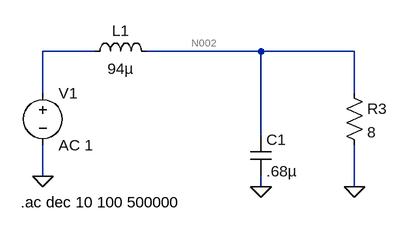
[diagram p0: schematic filter simulation.asc]
filter simulation.asc, the LTspice schematic file:
Version 4
SHEET 1 880 680
WIRE 64 112 -16 112
WIRE 320 112 144 112
WIRE 464 112 320 112
WIRE -16 176 -16 112
WIRE 464 176 464 112
WIRE 320 240 320 112
WIRE -16 304 -16 256
WIRE 320 320 320 304
WIRE 464 320 464 256
FLAG 464 320 0
FLAG 320 320 0
FLAG -16 304 0
SYMBOL ind 48 128 R270
WINDOW 0 32 56 VTop 2
WINDOW 3 5 56 VBottom 2
SYMATTR InstName L1
SYMATTR Value 94µ
SYMATTR SpiceLine Rser=2.22
SYMBOL cap 304 240 R0
SYMATTR InstName C1
SYMATTR Value .68µ
SYMATTR SpiceLine Rser=0.02
SYMBOL res 448 160 R0
SYMATTR InstName R3
SYMATTR Value 8
SYMBOL voltage -16 160 R0
SYMATTR InstName V1
SYMATTR Value AC 1
TEXT -50 344 Left 2 !.ac dec 10 100 500000

The netlist it stands for:
* filter simulation.asc
L1 N001 N002 94µ Rser=2.22
C1 N002 0 .68µ Rser=0.02
R3 N002 0 8
V1 N001 0 AC 1
.ac dec 10 100 500000
.backanno
.end

* Results of the author's LTspice run, read from the files saved beside the schematic
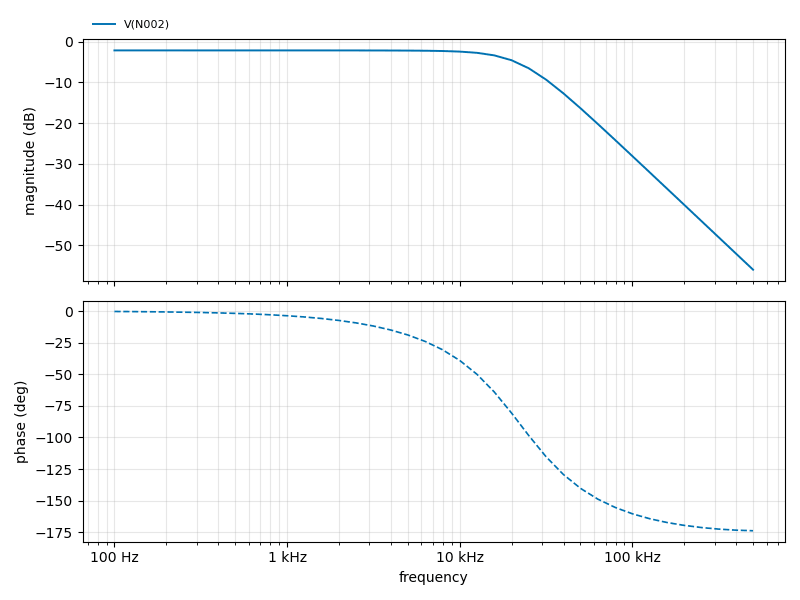
[diagram p1: AC Analysis of filter simulation.asc, plotted from the saved traces]
* AC Analysis, 1 run:
*   V(N002): -2.13 dB at 100 Hz, -56.01 dB at 500 kHz, peak -2.13 dB at 100 Hz, 3 dB below the peak at 21.39 kHz